# Altium project PCB_Project.PrjPcb (part 2 of 3)
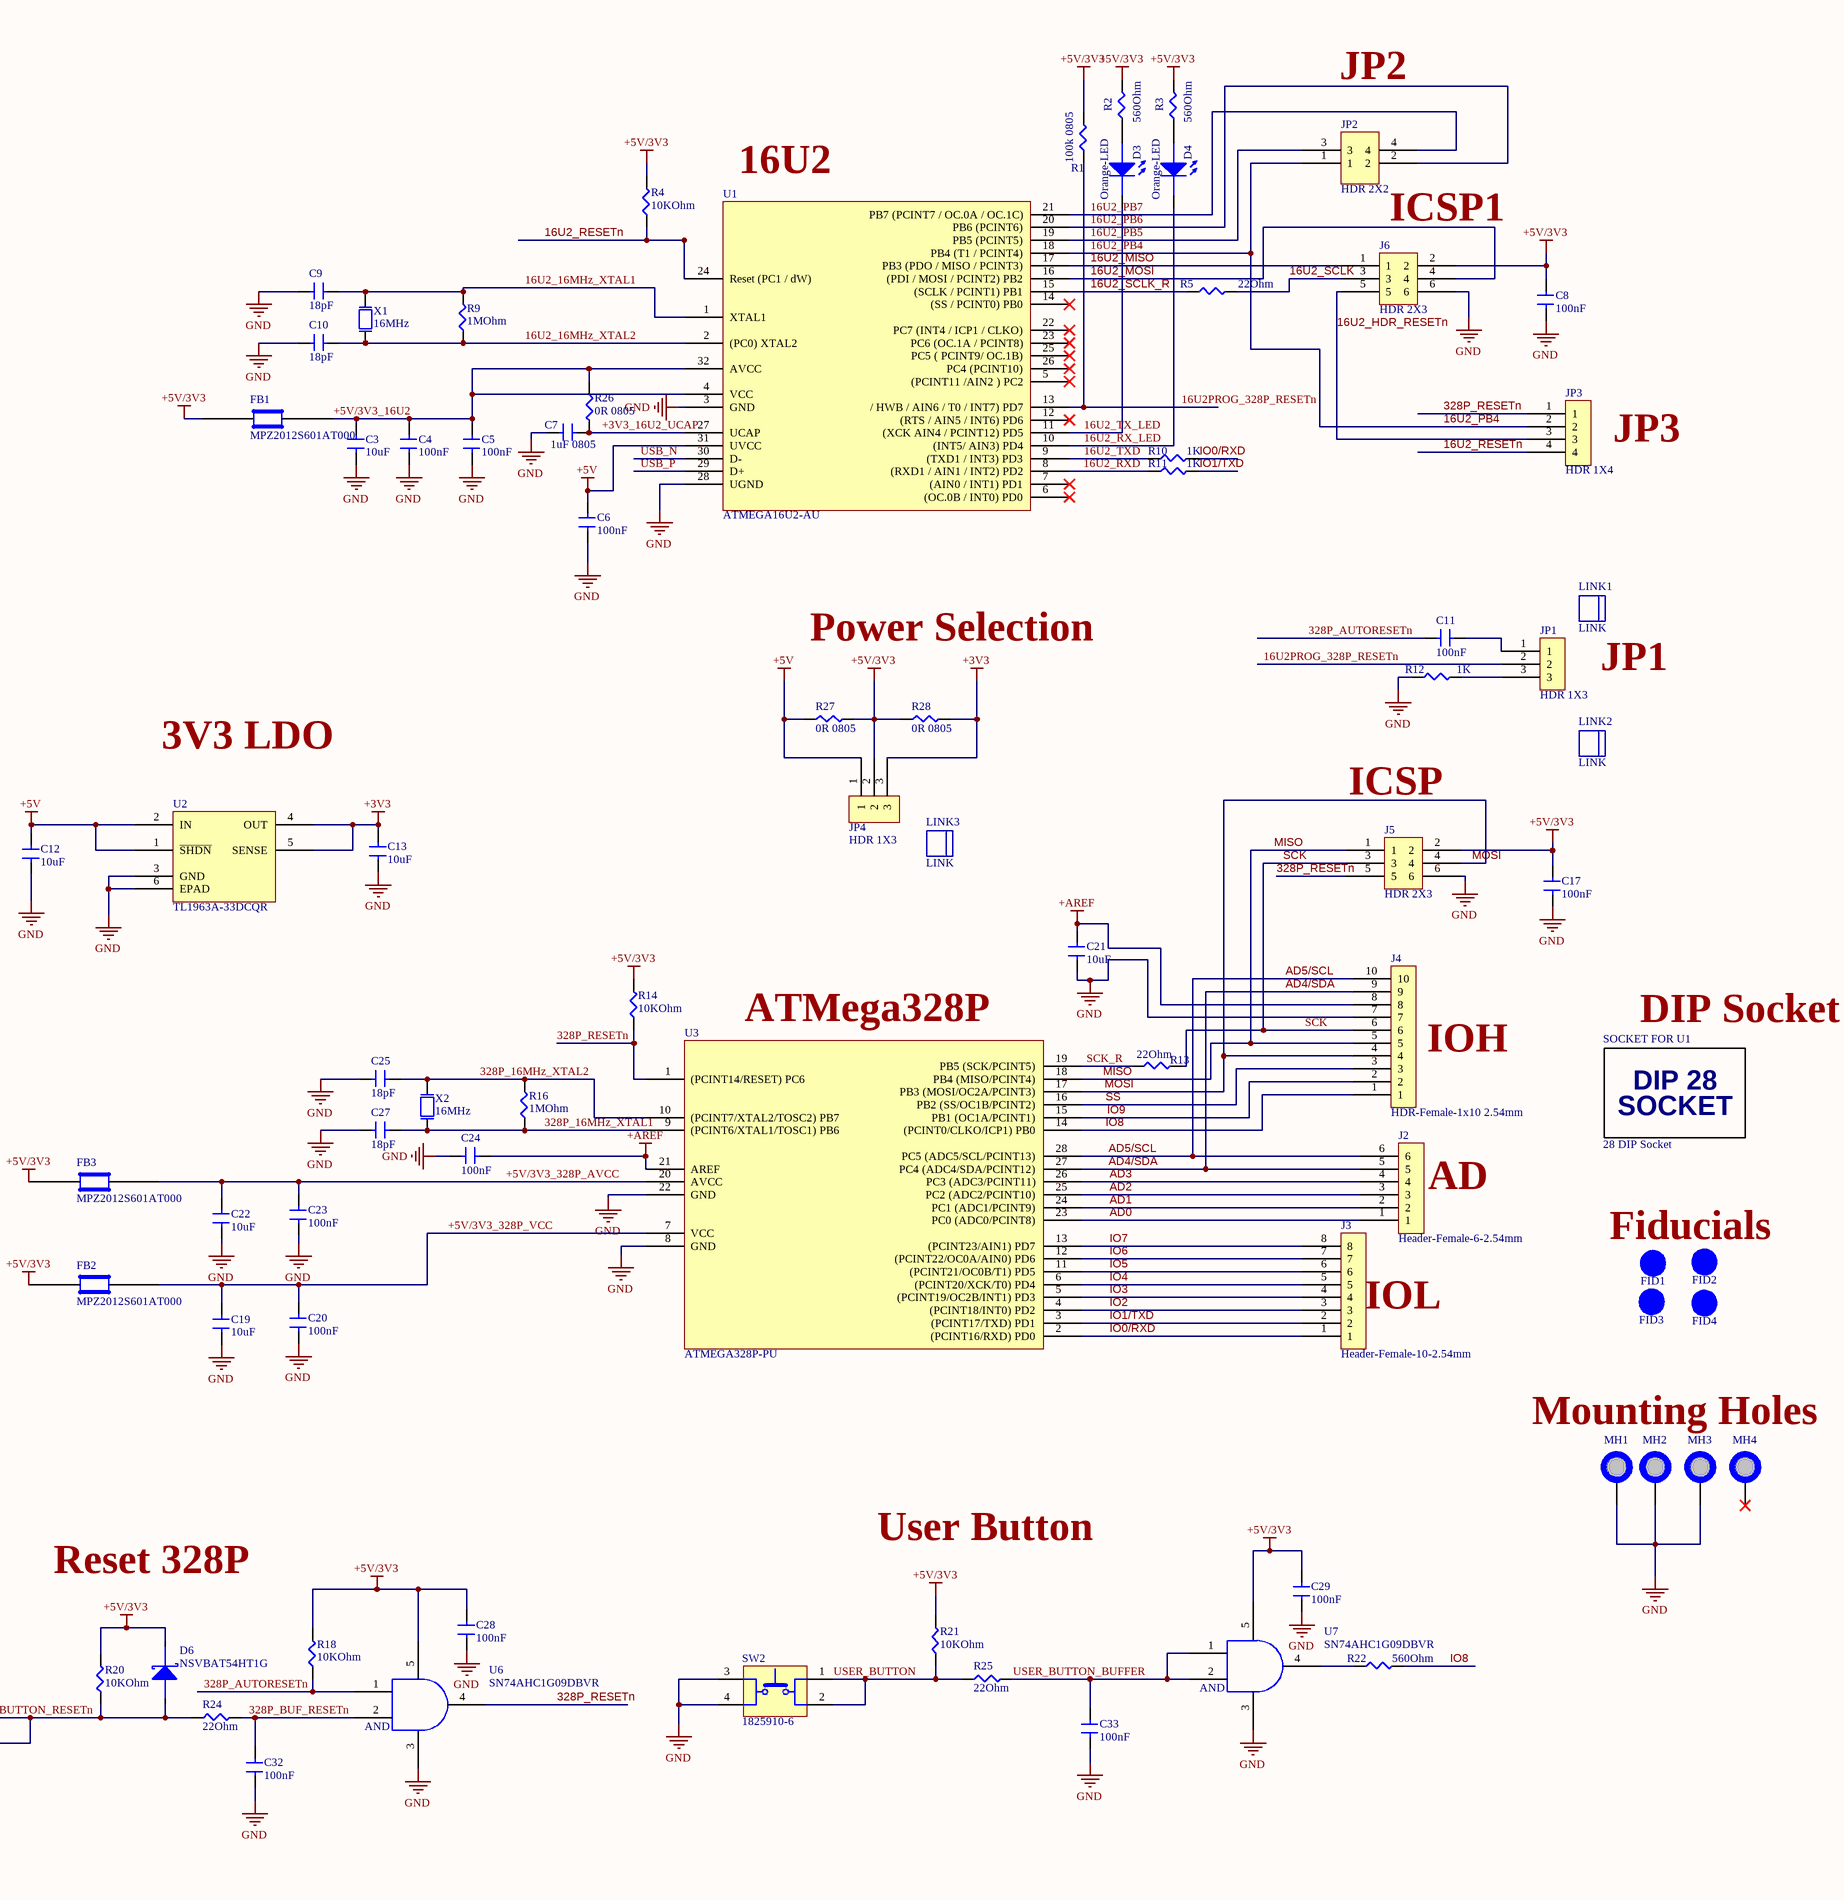
[diagram p2: Schematic.SchDoc, right]

## Sheet Schematic.SchDoc: 28 Pins (continued)
### Library data of the parts
C1 C2 = 100uF 10V: Cap Aluminum 100uF 10V 20% (5 X 5.4mm) SMD 50mA 1000 hr 85°C T/R; Manufacturer: Panasonic; Manufacturer Part Number: EEE-1AA101WR; Life (Hours): 1000Hour; Supplier 1: Digi-Key; Supplier Part Number 1: PCE3867CT-ND; RoHS: Yes; Category: Aluminum Electrolytic Capacitors; Stock 1: 119160; Pricing 1: 1=0.35000, 10=0.24300, 50=0.16180, 100=0.13740, 500=0.09702 (USD); Mount: Surface Mount,PCB; Case/Package: Radial; Contact Plating: Tin; Min Operating Temperature: -40°C; Max Operating Temperature: 85°C; Capacitance: 100uF; Voltage Rating: 10V; Tolerance: 20%; Ripple Current: 50mA; Packaging: Tape and Reel; Package Quantity: 1; Ripple Current (AC): 50mA; Voltage Rating (DC): 10V; Termination: SMD/SMT; Diameter: 5mm; Length: 5.5mm; Height: 5.4mm; Height - Seated (Max): 0.213inch; Radiation Hardening: No; REACH SVHC: Unknown; Lead Free: Lead Free; ComponentLink1URL: https://datasheet.ciiva.com/26945/getdatasheetpartid-169213-26945071.pdf?src-supplier=Verical; ComponentLink1Description: https://datasheet.ciiva.com/26945/getdatasheetpartid-169213-26945071.pdf?src-supplier=Verical; ComponentLink2URL: https://datasheet.ciiva.com/2983/aba0000ce2-2983906.pdf?src-supplier=Avnet; ComponentLink2Description: https://datasheet.ciiva.com/2983/aba0000ce2-2983906.pdf?src-supplier=Avnet; ComponentLink3URL: https://datasheet.ciiva.com/30075/11aba0000ce2-30075303.pdf?src-supplier=Onlinecomponents.com; ComponentLink3Description: https://datasheet.ciiva.com/30075/11aba0000ce2-30075303.pdf?src-supplier=Onlinecomponents.com; ComponentLink4URL: https://datasheet.ciiva.com/16427/aba0000ce2-16427544.pdf?src-supplier=Future+Electronics; ComponentLink4Description: https://datasheet.ciiva.com/16427/aba0000ce2-16427544.pdf?src-supplier=Future+Electronics; ComponentLink5URL: https://datasheet.ciiva.com/14598/70255710-14598233.pdf?src-supplier=Allied+Electronics; ComponentLink5Description: https://datasheet.ciiva.com/14598/70255710-14598233.pdf?src-supplier=Allied+Electronics; ComponentLink6URL: https://datasheet.ciiva.com/14605/70255710-14605689.pdf?src-supplier=Allied+Electronics; ComponentLink6Description: https://datasheet.ciiva.com/14605/70255710-14605689.pdf?src-supplier=Allied+Electronics; ComponentLink7URL: https://datasheet.ciiva.com/11673/aba0000ce2-11673882.pdf?src-supplier=Avnet; ComponentLink7Description: https://datasheet.ciiva.com/11673/aba0000ce2-11673882.pdf?src-supplier=Avnet; ComponentLink8URL: https://datasheet.ciiva.com/24027/aba0000ce2-40801-24027541.pdf?src-supplier=Mouser; ComponentLink8Description: https://datasheet.ciiva.com/24027/aba0000ce2-40801-24027541.pdf?src-supplier=Mouser
C3 C12 C13 C19 C21 C22 = 10uF: Ceramic capacitor SMD 0805 10 µF 16 V 10 %; Manufacturer: Samsung; Manufacturer Part Number: CL21A106KOQNNNG; Tolerance: 10%; Dielectric: X5R; Voltage: 16V; Supplier 1: Digi-Key; Supplier Part Number 1: 1276-6455-1-ND; RoHS: Yes; Category: Ceramic Capacitors; Stock 1: 689305; Pricing 1: 1=0.11000, 10=0.08300, 50=0.04500, 100=0.03680, 500=0.02626, 1000=0.02063 (USD); Mount: Surface Mount; Case/Package: 0805; Case Code (Imperial): 0805; Case Code (Metric): 2012; Material: Ceramic; Min Operating Temperature: -55°C; Max Operating Temperature: 85°C; Capacitance: 10uF; Packaging: Tape and Reel; Package Quantity: 3000; Voltage Rating: 16V; Length: 2mm; Width: 0.049inch; Height: 1.25mm; Depth: 1.25mm; Thickness: 0.053inch; ComponentLink1URL: https://datasheet.ciiva.com/25730/cl21a106koqnnng-25730226.pdf?src-supplier=Digi-Key; ComponentLink1Description: https://datasheet.ciiva.com/25730/cl21a106koqnnng-25730226.pdf?src-supplier=Digi-Key; ComponentLink2URL: https://datasheet.ciiva.com/29199/454932-da-01-en-vs-kondensator-0805-29199423.pdf?src-supplier=Conrad; ComponentLink2Description: https://datasheet.ciiva.com/29199/454932-da-01-en-vs-kondensator-0805-29199423.pdf?src-supplier=Conrad
C4-C6 C8 C11 C14-C17 C20 C23 C24 C26 C28-C34 = 100nF: Samsung Electro-Mechanics 100nF Multilayer Ceramic Capacitor (MLCC) 50 V 10% X7R dielectric CL max op. temp. +125C; Manufacturer Part Number: CL21B104KBCNNNC; Voltage Rating: 50V; Supplier 1: Digi-Key; Supplier Part Number 1: 1276-1003-1-ND; Manufacturer: Samsung; RoHS: Yes; Category: Ceramic Capacitors; Stock 1: 3107905; Pricing 1: 1=0.10000, 10=0.04700, 50=0.02560, 100=0.02100, 500=0.01498, 1000=0.01177 (USD); Mount: Surface Mount; Case/Package: 0805; Case Code (Metric): 2012; Case Code (Imperial): 0805; Material: Ceramic; Contact Plating: Tin; Min Operating Temperature: -55°C; Max Operating Temperature: 125°C; Tolerance: 10%; Packaging: Tape and Reel; Capacitance: 100nF; Dielectric: X7R; Voltage: 50V; Voltage Rating (DC): 50V; Length: 2mm; Width: 0.049inch; Height: 0.85mm; Thickness: 0.037inch; Depth: 1.25mm; Radiation Hardening: No; Lead Free: Lead Free; ComponentLink1URL: https://datasheet.ciiva.com/25710/cl21b104kbcnnnc-25710182.pdf?src-supplier=Digi-Key; ComponentLink1Description: https://datasheet.ciiva.com/25710/cl21b104kbcnnnc-25710182.pdf?src-supplier=Digi-Key; ComponentLink2URL: https://datasheet.ciiva.com/29199/454152-da-01-en-vs-kondensator-0805-29199814.pdf?src-supplier=Conrad; ComponentLink2Description: https://datasheet.ciiva.com/29199/454152-da-01-en-vs-kondensator-0805-29199814.pdf?src-supplier=Conrad
C7 = 1uF 0805: TDK - C2012X5R1E105K125AA - SMD Multilayer Ceramic Capacitor, 1 µF, 25 V, 0805 [2012 Metric], ± 10%, X5R, C Series; Voltage Rating: 25V; Supplier 1: Digi-Key; Supplier Part Number 1: 445-1419-1-ND; Manufacturer: TDK; Manufacturer Part Number: C2012X5R1E105K125AA; RoHS: Yes; Category: Ceramic Capacitors; Stock 1: 24598; Pricing 1: 1=0.23000, 10=0.15800, 50=0.09500, 100=0.08030, 500=0.05492, 1000=0.04858 (USD); Mount: Surface Mount; Case/Package: 0805; Number of Pins: 2; Dielectric Material: Ceramic; Case Code (Metric): 2012; Case Code (Imperial): 0805; Weight: 0.000194oz; Min Operating Temperature: -55°C; Max Operating Temperature: 85°C; Package Quantity: 2000; Capacitance: 1uF; Packaging: Tape and Reel; Voltage Rating (DC): 25V; Termination: SMD/SMT; Resistor Type: Ceramic; Voltage: 25V; Dielectric: X5R; Tolerance: 10%; Length: 2mm; Width: 0.049inch; Height: 1.25mm; Thickness: 0.057inch; Depth: 1.25mm; Radiation Hardening: No; Lead Free: Lead Free; REACH SVHC: No SVHC; ComponentLink1URL: https://datasheet.ciiva.com/11787/0900766b80c1bb00-11787608.pdf?src-supplier=RSComponents; ComponentLink1Description: https://datasheet.ciiva.com/11787/0900766b80c1bb00-11787608.pdf?src-supplier=RSComponents; ComponentLink2URL: https://datasheet.ciiva.com/16449/e412-c-16449595.pdf?src-supplier=Future+Electronics; ComponentLink2Description: https://datasheet.ciiva.com/16449/e412-c-16449595.pdf?src-supplier=Future+Electronics; ComponentLink3URL: https://datasheet.ciiva.com/28602/1744655-28602171.pdf?src-supplier=Element14; ComponentLink3Description: https://datasheet.ciiva.com/28602/1744655-28602171.pdf?src-supplier=Element14; ComponentLink4URL: https://datasheet.ciiva.com/15192/getdatasheetpartid-726707-15192140.pdf?src-supplier=Verical; ComponentLink4Description: https://datasheet.ciiva.com/15192/getdatasheetpartid-726707-15192140.pdf?src-supplier=Verical
C9 C10 C25 C27 = 18pF: KEMET - C0805C180K5GACTU - SMD Multilayer Ceramic Capacitor, 18 pF, 50 V, 0805 [2012 Metric], ± 10%, C0G / NP0, C Series KEMET; Voltage Rating: 50V; Dissipation Factor: 0.1%; Supplier 1: Digi-Key; Supplier Part Number 1: 399-8030-1-ND; Manufacturer: KEMET; Manufacturer Part Number: C0805C180K5GACTU; RoHS: Yes; Category: Ceramic Capacitors; Stock 1: 36978; Pricing 1: 1=0.11000, 10=0.07900, 50=0.04300, 100=0.03500, 500=0.02502, 1000=0.01966 (USD); Mount: Surface Mount; Case/Package: 0805; Case Code (Metric): 2012; Case Code (Imperial): 0805; Dielectric Material: Ceramic; Contact Plating: Tin,Matte; Min Operating Temperature: -55°C; Max Operating Temperature: 125°C; Package Quantity: 1; Capacitance: 18pF; Tolerance: 10%; Packaging: Tape and Reel; Voltage Rating (DC): 50V; Dielectric: C0G; Termination: SMD/SMT; Length: 2mm; Width: 0.049inch; Height: 0.78mm; Thickness: 0.035inch; Lead Pitch: 0.75mm; Depth: 1.25mm; Radiation Hardening: No; REACH SVHC: No SVHC; Lead Free: Lead Free; ComponentLink1URL: https://datasheet.ciiva.com/26847/getdatasheetpartid-742486-26847863.pdf?src-supplier=Verical; ComponentLink1Description: https://datasheet.ciiva.com/26847/getdatasheetpartid-742486-26847863.pdf?src-supplier=Verical; ComponentLink2URL: https://datasheet.ciiva.com/5412/kem-c1003-c0g-smd-356956-5412921.pdf?src-supplier=Mouser; ComponentLink2Description: https://datasheet.ciiva.com/5412/kem-c1003-c0g-smd-356956-5412921.pdf?src-supplier=Mouser
D1 = Green-LED: LED Uni-Color Green 572nm Automotive 2-Pin Chip 0603(1608Metric) T/R; Manufacturer: Osram Opto; Manufacturer Part Number: LGL29K-F2J1-24-Z; Lens Color: White; Forward Current: 20mA; Forward Voltage: 1.7V; Luminous Intensity: 3.5mcd; Viewing Angle: 160°; Lens Style: Flat,Diffused,Colorless,Rectangular; Lens Transparency: Diffused; Test Current: 2mA; Dominant Wavelength: 570nm; Luminous Flux: 0.015lm; Number of LEDs: 1; Lens Size: 0.8mm; Supplier 1: Digi-Key; Supplier Part Number 1: 475-3118-1-ND; RoHS: Yes; Category: Uncategorized; Mount: Surface Mount; Case/Package: 0603; Number of Pins: 2; Color: Green; Case Code (Metric): 1608; Case Code (Imperial): 0603; Min Operating Temperature: -40°C; Max Operating Temperature: 100°C; Packaging: Tape and Reel; Package Quantity: 5000; Illumination Color: Green; Length: 1.7mm; Width: 0.8mm; Height: 0.65mm; Radiation Hardening: No; ComponentLink1URL: http://components.arrow.com/part/dataview/41971649S9781339N2128?src-supplier=Arrow+Electronics; ComponentLink1Description: http://components.arrow.com/part/dataview/41971649S9781339N2128?src-supplier=Arrow+Electronics; ComponentLink2URL: http://components.arrow.com/part/dataview/0323_02006818?src-supplier=Arrow+Europe; ComponentLink2Description: http://components.arrow.com/part/dataview/0323_02006818?src-supplier=Arrow+Europe; ComponentLink3URL: http://catalog.osram-os.com/catalogue/catalogue.do;jsessionid=3DE84243E85F820603DAFD5199D8DDA3?act=downloadFile&favOid=020000020000138e000100b6&src-supplier=Avnet; ComponentLink3Description: http://catalog.osram-os.com/catalogue/catalogue.do;jsessionid=3DE84243E85F820603DAFD5199D8DDA3?act=downloadFile&favOid=020000020000138e000100b6&src-supplier=Avnet; ComponentLink4URL: https://dammedia.osram.info/media/resource/hires/osram-dam-2493945/LG%20L29K.pdf?src-supplier=Digi-Key; ComponentLink4Description: https://dammedia.osram.info/media/resource/hires/osram-dam-2493945/LG%20L29K.pdf?src-supplier=Digi-Key; ComponentLink5URL: http://catalog.osram-os.com/catalogue/catalogue.do;jsessionid=3DE84243E85F820603DAFD5199D8DDA3?act=downloadFile&favOid=020000020000138e000100b6&src-supplier=Avnet+Europe; ComponentLink5Description: http://catalog.osram-os.com/catalogue/catalogue.do;jsessionid=3DE84243E85F820603DAFD5199D8DDA3?act=downloadFile&favOid=020000020000138e000100b6&src-supplier=Avnet+Europe
D2-D4 = Orange-LED: OSRAM - LO L29K-H2K1-24-Z - SMARTLED 0603 ORANGE; Manufacturer: Osram Opto; Lens Color: White; Forward Current: 20mA; Forward Voltage: 2.2V; Luminous Intensity: 9mcd; Viewing Angle: 160°; Test Current: 2mA; Lens Style: Flat,Diffused,Colorless,Rectangular; Dominant Wavelength: 606nm; Luminous Flux: 0.025lm; Lens Transparency: Diffused; Number of Elements: 1; Reverse Voltage: 12V; Lens Size: 0.8mm; Supplier 1: Digi-Key; Supplier Part Number 1: 475-2740-2-ND; Manufacturer Part Number: LOL29K-H2K1-24-Z; RoHS: Yes; Category: Uncategorized; Mount: Surface Mount; Case/Package: 0603; Number of Pins: 2; Case Code (Metric): 1608; Color: Orange; Case Code (Imperial): 0603; Min Operating Temperature: -40°C; Max Operating Temperature: 100°C; Illumination Color: Orange; Packaging: Tape and Reel; Package Quantity: 5000; Number of LEDs: 1; Length: 1.3mm; Width: 0.8mm; Height: 0.65mm; Depth: 0.8mm; Radiation Hardening: No; ComponentLink1URL: https://datasheet.ciiva.com/2112/00077105-0-2112904.pdf?src-supplier=Digi-Key; ComponentLink1Description: https://datasheet.ciiva.com/2112/00077105-0-2112904.pdf?src-supplier=Digi-Key; ComponentLink2URL: https://datasheet.ciiva.com/2112/00077105-0-2112905.pdf?src-supplier=Digi-Key; ComponentLink2Description: https://datasheet.ciiva.com/2112/00077105-0-2112905.pdf?src-supplier=Digi-Key; ComponentLink3URL: https://datasheet.ciiva.com/2112/00077105-0-2112906.pdf?src-supplier=Digi-Key; ComponentLink3Description: https://datasheet.ciiva.com/2112/00077105-0-2112906.pdf?src-supplier=Digi-Key; ComponentLink4URL: https://datasheet.ciiva.com/15198/getdatasheetpartid-693885-15198412.pdf?src-supplier=Verical; ComponentLink4Description: https://datasheet.ciiva.com/15198/getdatasheetpartid-693885-15198412.pdf?src-supplier=Verical
D5 D6 = NSVBAT54HT1G: Schottky Diodes & Rectifiers SS SCHOTTKY DIODE; Manufacturer: ON Semiconductor; Forward Current: 200mA; Forward Voltage: 800mV; Max Power Dissipation: 200mW; Recovery Time: 5ns; Max Repetitive Reverse Voltage (Vrrm): 30V; Peak Non-Repetitive Surge Current: 600mA; Element Configuration: Single; Supplier 1: Digi-Key; Supplier Part Number 1: NSVBAT54HT1GOSCT-ND; Manufacturer Part Number: NSVBAT54HT1G; RoHS: Yes; Category: Schottky Diodes; Stock 1: 8813; Pricing 1: 1=0.48000, 10=0.34200, 100=0.17230, 500=0.15266, 1000=0.11880 (USD); Case/Package: SOD-323-2; Number of Pins: 2; Min Operating Temperature: -55°C; Max Operating Temperature: 150°C; Package Quantity: 3000; Packaging: Tape and Reel; Average Rectified Current: 200mA; Reverse Recovery Time: 5ns; Max Forward Surge Current (Ifsm): 600mA; Max Reverse Voltage (DC): 30V; Length: 1.8mm; Width: 1.35mm; Height: 0.9mm; Radiation Hardening: No; Lead Free: Lead Free; Halogen Free: Halogen Free; ComponentLink1URL: https://datasheet.ciiva.com/923/bat54ht1-d-923204.pdf?src-supplier=Digi-Key; ComponentLink1Description: https://datasheet.ciiva.com/923/bat54ht1-d-923204.pdf?src-supplier=Digi-Key; ComponentLink2URL: https://datasheet.ciiva.com/25932/bat54ht1-d-25932182.pdf?src-supplier=Avnet+Europe; ComponentLink2Description: https://datasheet.ciiva.com/25932/bat54ht1-d-25932182.pdf?src-supplier=Avnet+Europe
FB1-FB3 = MPZ2012S601AT000: FERRITE BEAD 600 OHM 0805 1LN; Manufacturer: TDK; Impedance: 600R; Current Rating: 2A; DC Resistance (DCR): 100mR; Supplier 1: Digi-Key; Supplier Part Number 1: 445-2206-1-ND; Manufacturer Part Number: MPZ2012S601AT000; RoHS: Yes; Category: Ferrite Beads and Chips; Stock 1: 186163; Pricing 1: 1=0.11000, 10=0.09200, 25=0.08240, 50=0.06040, 100=0.05220, 250=0.04116, 500=0.03478, 1000=0.02928 (USD); Mount: Surface Mount; Case/Package: 0805; Case Code (Metric): 2012; Case Code (Imperial): 0805; Packaging: Tape and Reel; Package Quantity: 1; Max DC Current: 2A; Length: 0.079inch; Width: 0.049inch; Height: 0.041inch; REACH SVHC: No SVHC; Lead Free: Lead Free; ComponentLink1URL: https://datasheet.ciiva.com/46634/beads-commercial-power-mpz-en-46634377.pdf?src-supplier=Digi-Key; ComponentLink1Description: https://datasheet.ciiva.com/46634/beads-commercial-power-mpz-en-46634377.pdf?src-supplier=Digi-Key; ComponentLink2URL: https://datasheet.ciiva.com/46634/beads-commercial-power-mpz-en-46634606.pdf?src-supplier=Digi-Key; ComponentLink2Description: https://datasheet.ciiva.com/46634/beads-commercial-power-mpz-en-46634606.pdf?src-supplier=Digi-Key; ComponentLink3URL: https://datasheet.ciiva.com/46634/beads-commercial-power-mpz-en-46634335.pdf?src-supplier=Digi-Key; ComponentLink3Description: https://datasheet.ciiva.com/46634/beads-commercial-power-mpz-en-46634335.pdf?src-supplier=Digi-Key
J1 J3 = Header-Female-8-2.54mm: CONN HDR 8POS 0.1 TIN PCB; Manufacturer: Sullins; Manufacturer Part Number: PPTC081LFBN-RC; Number of Positions: 8; Connector Type: Header,Socket; Pitch: 0.1inch; Supplier 1: Digi-Key; Supplier Part Number 1: S7006-ND; RoHS: Yes; Category: Connectors; Stock 1: 90645; Pricing 1: 1=0.65000, 10=0.60800, 100=0.46580, 500=0.40500, 1000=0.33413, 5000=0.29363, 10000=0.29250 (USD); Mount: Through Hole; Housing Material: Plastic; Contact Plating: Tin; Color: Black; Contact Material: Bronze; Package Quantity: 1000; Number of Rows: 1; Packaging: Bulk; Termination: Solder; Length: 20.8mm; Width: 2.5mm; Height: 8.5mm; Lead Free: Lead Free; ComponentLink1URL: https://media.digikey.com/pdf/Data%20Sheets/Sullins%20PDFs/Female_Headers.100_DS.pdf?src-supplier=Digi-Key; ComponentLink1Description: https://media.digikey.com/pdf/Data%20Sheets/Sullins%20PDFs/Female_Headers.100_DS.pdf?src-supplier=Digi-Key; ComponentLink2URL: http://www.sullinscorp.com/catalogs/78_Page80-81_HEADER_.100_2.54mm_FEMALE.pdf?src-supplier=Future+Electronics; ComponentLink2Description: http://www.sullinscorp.com/catalogs/78_Page80-81_HEADER_.100_2.54mm_FEMALE.pdf?src-supplier=Future+Electronics
J2 = Header-Female-6-2.54mm: Female, 6 C, Straight, .100"CC; 3.20mm Tail, No Mt. 100u" Tin; PBT, Phos Bronze, 105 C; Manufacturer: Sullins; Manufacturer Part Number: PPTC061LFBN-RC; Connector Type: Header,Socket; Number of Positions: 6; Pitch: 0.1inch; Supplier 1: Digi-Key; Supplier Part Number 1: S7004-ND; RoHS: Yes; Category: Connectors; Stock 1: 39129; Pricing 1: 1=0.52000, 10=0.48300, 100=0.37050, 500=0.32220, 1000=0.26582, 5000=0.23360, 10000=0.23270 (USD); Mount: Through Hole; Contact Material: Bronze; Housing Material: Plastic; Color: Black; Contact Plating: Tin; Package Quantity: 1000; Packaging: Bulk; Number of Rows: 1; Termination: Solder; Length: 15.7mm; Width: 2.5mm; Height: 8.5mm; Lead Free: Lead Free; ComponentLink1URL: https://media.digikey.com/pdf/Data%20Sheets/Sullins%20PDFs/Female_Headers.100_DS.pdf?src-supplier=Digi-Key; ComponentLink1Description: https://media.digikey.com/pdf/Data%20Sheets/Sullins%20PDFs/Female_Headers.100_DS.pdf?src-supplier=Digi-Key; ComponentLink2URL: http://www.sullinscorp.com/catalogs/78_Page80-81_HEADER_.100_2.54mm_FEMALE.pdf?src-supplier=Future+Electronics; ComponentLink2Description: http://www.sullinscorp.com/catalogs/78_Page80-81_HEADER_.100_2.54mm_FEMALE.pdf?src-supplier=Future+Electronics
J4 = Header-Female-2.54mm-10: CONN HDR 10POS 0.079 GOLD PCB; Manufacturer: Sullins; Manufacturer Part Number: NPPN101BFCN-RC; Current Rating: 1A; Gender: Female; Insulation Resistance: 5GR; Connector Type: Header,Socket; Number of Positions: 10; Pitch: 0.079inch; Supplier 1: Digi-Key; Supplier Part Number 1: S5751-10-ND; RoHS: Yes; Category: Connectors; Stock 1: 147597; Pricing 1: 1=0.98000, 10=0.86500, 100=0.74650, 500=0.61074, 1000=0.54288, 5000=0.49010 (USD); Mount: Through Hole; Contact Material: Bronze; Material: Nylon; Color: Black; Contact Plating: Gold; Min Operating Temperature: -40°C; Max Operating Temperature: 105°C; Termination: Solder; Package Quantity: 1000; Number of Rows: 1; Packaging: Bulk; Lead Free: Lead Free; ComponentLink1URL: https://datasheet.ciiva.com/745/75-1bfc-10483-745511.pdf?src-supplier=Digi-Key; ComponentLink1Description: https://datasheet.ciiva.com/745/75-1bfc-10483-745511.pdf?src-supplier=Digi-Key
J5 J6 = HDR 2X3: BOARD-BOARD CONNECTOR HEADER, 6 POSITION, 2ROW; Product Range:AMPMODU Mod II Series; Contact Termination Type:Through Hole; Gender:Header; No. of Contacts:6; Pitch Spacing:2.54mm; Contact Plating:Gold Plated Contacts; No. of Rows:2 ;RoHS Compliant: Yes; Manufacturer: TE Connectivity; Manufacturer Part Number: 87227-3; Number of Positions: 6; Insulation Resistance: 5GR; Board Standoff: No (Without); High Speed Serial Data Connector: No; PCB Mount Retention: Without; Gender: Male; Connector Type: Connector,Pin; Contact Current Rating: 3A; Pitch: 2.54mm; Contact Post Length: 0.125inch; PCB Thickness: 1.4mm; Approvals: CSA,UL; Supplier 1: Digi-Key; Supplier Part Number 1: A26569-ND; RoHS: Yes; Category: Connectors; Stock 1: 8708; Pricing 1: 1=2.64000, 10=2.39300, 100=2.05120, 500=1.70934, 1000=1.46514, 5000=1.29909, 10000=1.26979 (USD); Mount: Through Hole; Contact Shape: Square; Housing Material: Thermoplastic; Contact Plating: Gold; Contact Material: Bronze; Color: Black; Housing Color: Black; Min Operating Temperature: -65°C; Max Operating Temperature: 105°C; Termination: Through Hole; Number of Contacts: 6; Contact Protection: No (Without); Gasket: No (Without); High Temperature Housing: No; Keyed: No; Mating Alignment: No (Without); Mating Connector Lock: No (Without); Panel Mount Retention: No (Without); Selectively Loaded: No (Without); Stabilizers: No (Without); Strain Relief: No (Without); Contact Gender: Male; Current Rating: 3A; Package Quantity: 520; Packaging: Carton; Number of Rows: 2; Orientation: Straight; Mounting Ears: No (Without); Length: 7.21mm; Row Spacing: 2.54mm; Contact Mating Length: 8.08mm; Depth: 5.08mm; Radiation Hardening: No; REACH SVHC: Unknown; ELV: Compliant; Lead Free: Lead Free; Flammability Rating: UL94 V-0; ComponentLink1URL: https://datasheet.ciiva.com/27055/1934542-27055082.pdf?src-supplier=Jameco; ComponentLink1Description: https://datasheet.ciiva.com/27055/1934542-27055082.pdf?src-supplier=Jameco; ComponentLink2URL: https://datasheet.ciiva.com/710/eng-cd-87227-h4-710306.pdf?src-supplier=Digi-Key; ComponentLink2Description: https://datasheet.ciiva.com/710/eng-cd-87227-h4-710306.pdf?src-supplier=Digi-Key; ComponentLink3URL: https://datasheet.ciiva.com/8047/eng-cs-1307819-section-5-0908-8047543.pdf?src-supplier=Element14; ComponentLink3Description: https://datasheet.ciiva.com/8047/eng-cs-1307819-section-5-0908-8047543.pdf?src-supplier=Element14; ComponentLink4URL: https://datasheet.ciiva.com/16684/eng-ds-1307819-ampmodu-0811-16684234.pdf?src-supplier=Avnet+Europe; ComponentLink4Description: https://datasheet.ciiva.com/16684/eng-ds-1307819-ampmodu-0811-16684234.pdf?src-supplier=Avnet+Europe; ComponentLink5URL: https://datasheet.ciiva.com/3118/eng-ds-1307819-ampmodu-0811-3118588.pdf?src-supplier=Avnet; ComponentLink5Description: https://datasheet.ciiva.com/3118/eng-ds-1307819-ampmodu-0811-3118588.pdf?src-supplier=Avnet; ComponentLink6URL: https://datasheet.ciiva.com/14645/70082847-14645500.pdf?src-supplier=Allied+Electronics; ComponentLink6Description: https://datasheet.ciiva.com/14645/70082847-14645500.pdf?src-supplier=Allied+Electronics; ComponentLink7URL: https://datasheet.ciiva.com/15175/getdatasheetpartid-36807-15175478.pdf?src-supplier=Verical; ComponentLink7Description: https://datasheet.ciiva.com/15175/getdatasheetpartid-36807-15175478.pdf?src-supplier=Verical
J7 = 10118193-0001LF: CONN USB MICRO B RECPT SMT R/A; Manufacturer: Amphenol FCI; Number of Terminals/Pins: 5; Gender: Female; Current Rating: 1.8A; Connector Type: USB,Receptacle; Number of Ports: 1; Insulation Resistance: 1GR; Max Voltage Rating (AC): 100V; Pitch: 0.65mm; Supplier 1: Digi-Key; Supplier Part Number 1: 609-4616-1-ND; Manufacturer Part Number: 10118193-0001LF; RoHS: Yes; Category: USB Connectors; Stock 1: 41614; Pricing 1: 1=0.48000, 10=0.45100, 25=0.38680, 50=0.32860, 100=0.31580, 250=0.28360, 500=0.27070 (USD); Mount: Surface Mount,Horizontal; Contact Plating: Gold; Contact Material: Copper Alloy; Housing Material: Polymer; Color: Black; Min Operating Temperature: -55°C; Max Operating Temperature: 85°C; Packaging: Tape and Reel; Number of Contacts: 5; Termination: Solder; Package Quantity: 1200; Voltage Rating: 100V; Orientation: Right Angle; Features: Shielded; Length: 7.86mm; Depth: 5.67mm; Radiation Hardening: No; Flammability Rating: UL94 V-0; ComponentLink1URL: https://datasheet.ciiva.com/851/10118193-851106.pdf?src-supplier=Digi-Key; ComponentLink1Description: https://datasheet.ciiva.com/851/10118193-851106.pdf?src-supplier=Digi-Key; ComponentLink2URL: https://datasheet.ciiva.com/26853/getdatasheetpartid-418618-26853893.pdf?src-supplier=Verical; ComponentLink2Description: https://datasheet.ciiva.com/26853/getdatasheetpartid-418618-26853893.pdf?src-supplier=Verical; ComponentLink3URL: https://datasheet.ciiva.com/4598/10118193ac-197151-4598799.pdf?src-supplier=Mouser; ComponentLink3Description: https://datasheet.ciiva.com/4598/10118193ac-197151-4598799.pdf?src-supplier=Mouser; ComponentLink4URL: https://datasheet.ciiva.com/14802/10118193-0001lf-webpage-14802386.pdf?src-supplier=Arrow+Electronics; ComponentLink4Description: https://datasheet.ciiva.com/14802/10118193-0001lf-webpage-14802386.pdf?src-supplier=Arrow+Electronics; ComponentLink5URL: https://datasheet.ciiva.com/851/10118193-851107.pdf?src-supplier=Digi-Key; ComponentLink5Description: https://datasheet.ciiva.com/851/10118193-851107.pdf?src-supplier=Digi-Key; ComponentLink6URL: https://datasheet.ciiva.com/851/10118193-851108.pdf?src-supplier=Digi-Key; ComponentLink6Description: https://datasheet.ciiva.com/851/10118193-851108.pdf?src-supplier=Digi-Key; ComponentLink7URL: https://datasheet.ciiva.com/14618/70236827-14618887.pdf?src-supplier=Allied+Electronics; ComponentLink7Description: https://datasheet.ciiva.com/14618/70236827-14618887.pdf?src-supplier=Allied+Electronics
J8 J9 = PAD_WITH_HOLE_4mmx1.5mm
JP1 JP4 = HDR 1X3: BERGSTIK II .100" SR STRAIGHT; Manufacturer: Amphenol FCI; Manufacturer Part Number: 68001-403HLF; Connector Type: Male Pin; Number of Positions: 3; Max Voltage Rating (AC): 1.5kV; Gender: Male; Insulation Resistance: 5GR; Current Rating: 3A; Pitch: 2.54mm; Contact Post Length: 3.05mm; Supplier 1: Digi-Key; Supplier Part Number 1: 609-3471-ND; RoHS: Yes; Category: Headers and Wire Housings; Stock 1: 1924; Pricing 1: 1=0.20000, 10=0.18400, 100=0.12740, 500=0.10780, 1000=0.08820, 5000=0.07840, 10000=0.07105 (USD); Mount: Through Hole; Housing Material: Thermoplastic; Housing Color: Black; Contact Plating: Tin; Contact Material: Bronze; Color: Black; Min Operating Temperature: -65°C; Max Operating Temperature: 125°C; Termination: Solder; Number of Contacts: 3; Orientation: Straight; Number of Rows: 1; Packaging: Bulk; Package Quantity: 100; Voltage Rating: 1.5kV; Contact Gender: Male; Length: 7.62mm; Depth: 2.41mm; Contact Mating Length: 0.23inch; Radiation Hardening: No; REACH SVHC: No SVHC; Flammability Rating: UL94 V-0; ComponentLink1URL: https://datasheet.ciiva.com/731/68000-731069.pdf?src-supplier=Digi-Key; ComponentLink1Description: https://datasheet.ciiva.com/731/68000-731069.pdf?src-supplier=Digi-Key; ComponentLink2URL: https://datasheet.ciiva.com/10149/68000-10149609.pdf?src-supplier=Avnet; ComponentLink2Description: https://datasheet.ciiva.com/10149/68000-10149609.pdf?src-supplier=Avnet; ComponentLink3URL: https://datasheet.ciiva.com/22872/70302503-22872970.pdf?src-supplier=Allied+Electronics; ComponentLink3Description: https://datasheet.ciiva.com/22872/70302503-22872970.pdf?src-supplier=Allied+Electronics
JP2 = HDR 2X2: 67996-404HLF-BERG II 100CC DR ST ;ROHS COMPLIANT: YES; Manufacturer: Amphenol FCI; Connector Type: Male Pin; Voltage Rating: 1.5kV; Number of Positions: 4; Gender: Male; Current Rating: 3A; Insulation Resistance: 5GR; Pitch: 2.54mm; Row Spacing: 0.1inch; Contact Post Length: 2.41mm; Supplier 1: Digi-Key; Supplier Part Number 1: 609-3390-ND; Manufacturer Part Number: 67996-404HLF; RoHS: Yes; Category: Headers and Wire Housings; Stock 1: 2384; Pricing 1: 1=0.24000, 10=0.22400, 100=0.15520, 500=0.13134, 1000=0.10746, 5000=0.09552, 10000=0.08657 (USD); Mount: Through Hole; Housing Material: Thermoplastic; Color: Black; Housing Color: Black; Contact Plating: Tin; Contact Material: Bronze; Min Operating Temperature: -65°C; Max Operating Temperature: 125°C; Number of Rows: 2; Packaging: Bulk; Package Quantity: 100; Orientation: Straight; Termination: Solder; Max Voltage Rating (AC): 1.5kV; Contact Gender: Male; Number of Contacts: 4; Length: 5.08mm; Depth: 4.83mm; Contact Mating Length: 0.23inch; Radiation Hardening: No; Lead Free: Lead Free; ComponentLink1URL: https://datasheet.ciiva.com/721/67996-721035.pdf?src-supplier=Digi-Key; ComponentLink1Description: https://datasheet.ciiva.com/721/67996-721035.pdf?src-supplier=Digi-Key; ComponentLink2URL: https://datasheet.ciiva.com/10149/67996-10149733.pdf?src-supplier=Avnet; ComponentLink2Description: https://datasheet.ciiva.com/10149/67996-10149733.pdf?src-supplier=Avnet; ComponentLink3URL: https://datasheet.ciiva.com/16726/67996-16726280.pdf?src-supplier=Avnet+Europe; ComponentLink3Description: https://datasheet.ciiva.com/16726/67996-16726280.pdf?src-supplier=Avnet+Europe
JP3 = HDR 1X4: CONN HEADER VERT 4POS 2.54MM; Manufacturer: Amphenol FCI; Manufacturer Part Number: 68000-204HLF; Number of Positions: 4; Max Voltage Rating (AC): 1.5kV; Gender: Male; Connector Type: Male Pin; Insulation Resistance: 5GR; Current Rating: 3A; Contact Post Length: 2.41mm; Supplier 1: Digi-Key; Supplier Part Number 1: 609-3255-ND; RoHS: Yes; Category: Connectors; Stock 1: 1643; Pricing 1: 1=0.33000, 10=0.31600, 100=0.22150, 500=0.18984, 1000=0.15820, 5000=0.13560, 10000=0.12656 (USD); Mount: Through Hole; Housing Color: Black; Color: Black; Contact Plating: Gold,GXT; Contact Material: Bronze; Housing Material: Thermoplastic; Min Operating Temperature: -65°C; Max Operating Temperature: 125°C; Termination: Solder; Number of Contacts: 4; Orientation: Straight; Package Quantity: 100; Number of Rows: 1; Packaging: Bulk; Voltage Rating: 1.5kV; Contact Gender: Male; Length: 10.16mm; Pitch: 2.54mm; Depth: 2.41mm; Contact Mating Length: 0.23inch; Radiation Hardening: No; Flammability Rating: UL94 V-0; ComponentLink1URL: https://datasheet.ciiva.com/5149/68000-274280-5149869.pdf?src-supplier=Mouser; ComponentLink1Description: https://datasheet.ciiva.com/5149/68000-274280-5149869.pdf?src-supplier=Mouser; ComponentLink2URL: https://datasheet.ciiva.com/728/68000-728901.pdf?src-supplier=Digi-Key; ComponentLink2Description: https://datasheet.ciiva.com/728/68000-728901.pdf?src-supplier=Digi-Key; ComponentLink3URL: https://datasheet.ciiva.com/22873/70302489-22873093.pdf?src-supplier=Allied+Electronics; ComponentLink3Description: https://datasheet.ciiva.com/22873/70302489-22873093.pdf?src-supplier=Allied+Electronics; ComponentLink4URL: https://datasheet.ciiva.com/10149/68000-10149835.pdf?src-supplier=Avnet; ComponentLink4Description: https://datasheet.ciiva.com/10149/68000-10149835.pdf?src-supplier=Avnet; ComponentLink5URL: https://datasheet.ciiva.com/46395/1914865-46395853.pdf?src-supplier=Element14; ComponentLink5Description: https://datasheet.ciiva.com/46395/1914865-46395853.pdf?src-supplier=Element14
L1 = 2.2uH: FIXED IND 2.2UH 2A 80 MOHM SMD; Manufacturer: KEMET; Manufacturer Part Number: L1210R2R2MDWIT; Core Material: Ferrite; Tolerance: 20%; Shielding: Unshielded; Self Resonant Frequency: 190MHz; DC Resistance (DCR): 80mR; Test Frequency: 100kHz; DC Current: 1.13A; Supplier 1: Digi-Key; Supplier Part Number 1: 399-9598-1-ND; RoHS: Yes; Category: Fixed Inductors; Stock 1: 15069; Pricing 1: 1=0.48000, 10=0.41700, 25=0.38680, 50=0.32720, 100=0.29750, 250=0.27964, 500=0.24990 (USD); Mount: Surface Mount; Case/Package: 1210; Case Code (Metric): 3225; Case Code (Imperial): 1210; Min Operating Temperature: -40°C; Max Operating Temperature: 105°C; Package Quantity: 1000; Current Rating: 2A; Packaging: Tape and Reel; Inductance Tolerance: 20%; Resistor Type: Wirewound,Ceramic; Inductance: 2.2uH; Max DC Current: 2A; Termination: SMD/SMT; Length: 0.126inch; Width: 0.098inch; Height: 2.5mm; Height - Seated (Max): 0.106inch; Depth: 2.7mm; Radiation Hardening: No; REACH SVHC: No SVHC; Military Standard: Not; ComponentLink1URL: https://datasheet.ciiva.com/4957/f3115-4957838.pdf?src-supplier=Mouser; ComponentLink1Description: https://datasheet.ciiva.com/4957/f3115-4957838.pdf?src-supplier=Mouser; ComponentLink2URL: https://datasheet.ciiva.com/6691/f3115-6691487.pdf?src-supplier=Digi-Key; ComponentLink2Description: https://datasheet.ciiva.com/6691/f3115-6691487.pdf?src-supplier=Digi-Key; ComponentLink3URL: https://datasheet.ciiva.com/8512/f3115-8512543.pdf?src-supplier=Avnet; ComponentLink3Description: https://datasheet.ciiva.com/8512/f3115-8512543.pdf?src-supplier=Avnet; ComponentLink4URL: https://datasheet.ciiva.com/17280/f3115-17280270.pdf?src-supplier=Avnet+Europe; ComponentLink4Description: https://datasheet.ciiva.com/17280/f3115-17280270.pdf?src-supplier=Avnet+Europe; ComponentLink5URL: https://datasheet.ciiva.com/22685/27262-22685038.pdf?src-supplier=Element14; ComponentLink5Description: https://datasheet.ciiva.com/22685/27262-22685038.pdf?src-supplier=Element14
LINK1-LINK3 = LINK: CONN JUMPER SHORTING .100" GOLD; Manufacturer: Sullins; Manufacturer Part Number: QPC02SXGN-RC; Number of Positions: 2; Pitch: 0.1inch; Supplier 1: Digi-Key; Supplier Part Number 1: S9337-ND; RoHS: Yes; Category: Connectors; Stock 1: 716811; Pricing 1: 1=0.10000, 25=0.04400, 50=0.03780, 250=0.03152, 750=0.02835, 1000=0.02646, 12000=0.02016, 24000=0.01827, 48000=0.01820 (USD); Case/Package: 100; Contact Plating: Gold; Package Quantity: 2000; Packaging: Bulk; Height: 0.235inch; Lead Free: Lead Free; ComponentLink1URL: https://datasheet.ciiva.com/767/284-sxgn-11510-767869.pdf?src-supplier=Digi-Key; ComponentLink1Description: https://datasheet.ciiva.com/767/284-sxgn-11510-767869.pdf?src-supplier=Digi-Key
R1 = 100k 0805: YAGEO         RC0805FR-07100KL            RES, THICK FILM, 100K, 1%, 0.125W, 0805, REEL; Resistance: 100kR; Temperature Coefficient: 100ppm/°C; Voltage Rating (DC): 150V; Power Rating: 125mW; Supplier 1: Digi-Key; Supplier Part Number 1: 311-100KCRCT-ND; Manufacturer: Yageo; Manufacturer Part Number: RC0805FR-07100KL; RoHS: Yes; Category: Chip SMD Resistors; Stock 1: 2366254; Pricing 1: 1=0.10000, 10=0.03600, 100=0.01470, 1000=0.00660, 2500=0.00573 (USD); Case/Package: 0805; Number of Pins: 2; Case Code (Metric): 2012; Case Code (Imperial): 0805; Min Operating Temperature: -55°C; Max Operating Temperature: 155°C; Tolerance: 1%; Packaging: Tape and Reel; Resistor Type: Thick Film; Voltage Rating: 150V; Package Quantity: 1; Number of Terminations: 2; Termination: SMD/SMT; Max Power Dissipation: 125mW; Features: Moisture Resistant; Length: 2mm; Width: 0.049inch; Height: 0.024inch; Depth: 1.25mm; Lead Pitch: 0.4mm; REACH SVHC: Unknown; Lead Free: Lead Free; Military Standard: Not
R2 R3 R15 R17 R22 = 560Ohm: RES SMD 560 OHM 1% 1/8W 0805; Manufacturer: Yageo; Manufacturer Part Number: RT0805FRE07560RL; Resistance: 560R; Power Rating: 125mW; Voltage Rating: 150V; Temperature Coefficient: 50ppm/°C; Supplier 1: Digi-Key; Supplier Part Number 1: 13-RT0805FRE07560RLCT-ND; RoHS: Yes; Category: Chip SMD Resistors; Stock 1: 9840; Pricing 1: 1=0.10000, 10=0.08000, 100=0.03100, 1000=0.01362, 2500=0.01176 (USD); Case/Package: 0805; Number of Pins: 2; Case Code (Imperial): 0805; Case Code (Metric): 2012; Contact Plating: Tin,Matte; Min Operating Temperature: -55°C; Max Operating Temperature: 125°C; Tolerance: 1%; Packaging: Tape and Reel; Package Quantity: 5000; Resistor Type: Thin Film; Termination: SMD/SMT; Number of Terminations: 2; Max Power Dissipation: 125mW; Voltage Rating (DC): 150V; Length: 2mm; Width: 1.25mm; Height: 0.024inch; Depth: 1.25mm; Radiation Hardening: No; REACH SVHC: No SVHC; Military Standard: Not; Lead Free: Lead Free; ComponentLink1URL: https://datasheet.ciiva.com/12834/pyu-rt-1-to-0-05-rohs-l-4-12834166.pdf?src-supplier=Mouser; ComponentLink1Description: https://datasheet.ciiva.com/12834/pyu-rt-1-to-0-05-rohs-l-4-12834166.pdf?src-supplier=Mouser; ComponentLink2URL: https://datasheet.ciiva.com/2561/pyu-rt-1-to-0-05-rohs-l-5-2561303.pdf?src-supplier=Digi-Key; ComponentLink2Description: https://datasheet.ciiva.com/2561/pyu-rt-1-to-0-05-rohs-l-5-2561303.pdf?src-supplier=Digi-Key; ComponentLink3URL: https://datasheet.ciiva.com/7942/1392914-7942159.pdf?src-supplier=Element14; ComponentLink3Description: https://datasheet.ciiva.com/7942/1392914-7942159.pdf?src-supplier=Element14
R4 R14 R18-R21 = 10KOhm: RES SMD 10K OHM 1% 1/8W 0805; Manufacturer: Yageo; Manufacturer Part Number: AC0805FR-0710KL; Resistance: 10kR; Power Rating: 125mW; Voltage Rating: 150V; Temperature Coefficient: 100ppm/°C; Supplier 1: Digi-Key; Supplier Part Number 1: 311-10KLGCT-ND; RoHS: Yes; Category: Chip SMD Resistors; Stock 1: 428651; Pricing 1: 1=0.10000, 10=0.04400, 100=0.01780, 1000=0.00798, 2500=0.00692 (USD); Case/Package: 0805; Case Code (Metric): 2012; Case Code (Imperial): 0805; Min Operating Temperature: -55°C; Max Operating Temperature: 155°C; Packaging: Tape and Reel; Tolerance: 1%; Package Quantity: 1; Resistor Type: Thick Film; Number of Terminations: 2; Termination: SMD/SMT; Max Power Dissipation: 125mW; Features: Moisture Resistant,Automotive AEC-Q200,Anti-Sulfur; Length: 0.079inch; Width: 0.049inch; Height: 0.024inch; Depth: 1.25mm; Military Standard: Not; Lead Free: Lead Free; ComponentLink1URL: https://datasheet.ciiva.com/5558/pyu-ac-51-rohs-l-2-5558347.pdf?src-supplier=Mouser; ComponentLink1Description: https://datasheet.ciiva.com/5558/pyu-ac-51-rohs-l-2-5558347.pdf?src-supplier=Mouser
R5-R7 R13 R23-R25 = 22Ohm: YAGEO         RC0805FR-072R2L             RES, THICK FILM, 2R2, 1%, 0.125W, 0805; Temperature Coefficient: 200ppm/°C; Resistance: 2.2R; Power Rating: 125mW; Voltage Rating: 150V; Supplier 1: Digi-Key; Supplier Part Number 1: 311-2.20CRCT-ND; Manufacturer: Yageo; Manufacturer Part Number: RC0805FR-072R2L; RoHS: Yes; Category: Chip SMD Resistors; Stock 1: 157807; Pricing 1: 1=0.10000, 10=0.07200, 100=0.02940, 1000=0.01322, 2500=0.01148 (USD); Case/Package: 0805; Number of Pins: 2; Case Code (Imperial): 0805; Case Code (Metric): 2012; Min Operating Temperature: -55°C; Max Operating Temperature: 155°C; Tolerance: 1%; Packaging: Tape and Reel; Termination: SMD/SMT; Resistor Type: Thick Film; Voltage Rating (DC): 150V; Length: 2mm; Width: 1.25mm; Height: 0.5mm; Depth: 1.25mm; Lead Free: Lead Free; REACH SVHC: No SVHC; Military Standard: Not; ComponentLink1URL: https://datasheet.ciiva.com/11808/0900766b8106beab-11808233.pdf?src-supplier=RSComponents; ComponentLink1Description: https://datasheet.ciiva.com/11808/0900766b8106beab-11808233.pdf?src-supplier=RSComponents; ComponentLink2URL: https://datasheet.ciiva.com/46447/444164-46447576.pdf?src-supplier=Element14; ComponentLink2Description: https://datasheet.ciiva.com/46447/444164-46447576.pdf?src-supplier=Element14
R8 R26-R28 = 0R 0805: Surface Mount Thick Film Resistor, RC Series, 125 mW, - 5%, 150 V, 0805 [2012 Metric]; Manufacturer: Yageo; Manufacturer Part Number: RC0805JR-070RL; Resistance: 0mR; Voltage Rating: 150V; Power Rating: 125mW; Temperature Coefficient: 200ppm/°C; Supplier 1: Digi-Key; Supplier Part Number 1: 311-0.0ARCT-ND; RoHS: Yes; Category: Chip SMD Resistors; Stock 1: 4227385; Pricing 1: 1=0.10000, 10=0.03100, 25=0.02240, 50=0.01720, 100=0.01260, 250=0.00964, 500=0.00770, 1000=0.00567 (USD); Case/Package: 0805; Number of Pins: 2; Case Code (Imperial): 0805; Case Code (Metric): 2012; Contact Plating: Tin,Matte; Min Operating Temperature: -55°C; Max Operating Temperature: 155°C; Packaging: Tape and Reel; Tolerance: 5%; Voltage Rating (DC): 150V; Termination: SMD/SMT; Resistor Type: Thick Film; Length: 2mm; Width: 1.25mm; Height: 0.5mm; Depth: 1.25mm; Radiation Hardening: No; REACH SVHC: Unknown; Military Standard: Not; Lead Free: Lead Free; ComponentLink1URL: https://datasheet.ciiva.com/7941/1738694-7941861.pdf?src-supplier=Element14; ComponentLink1Description: https://datasheet.ciiva.com/7941/1738694-7941861.pdf?src-supplier=Element14; ComponentLink2URL: https://datasheet.ciiva.com/11819/0900766b8106beab-11819430.pdf?src-supplier=RSComponents; ComponentLink2Description: https://datasheet.ciiva.com/11819/0900766b8106beab-11819430.pdf?src-supplier=RSComponents; ComponentLink3URL: https://datasheet.ciiva.com/7941/1738694-7941862.pdf?src-supplier=Element14; ComponentLink3Description: https://datasheet.ciiva.com/7941/1738694-7941862.pdf?src-supplier=Element14; ComponentLink4URL: https://datasheet.ciiva.com/7941/1738694-7941863.pdf?src-supplier=Element14; ComponentLink4Description: https://datasheet.ciiva.com/7941/1738694-7941863.pdf?src-supplier=Element14; ComponentLink5URL: https://datasheet.ciiva.com/15190/getdatasheetpartid-330685-15190028.pdf?src-supplier=Verical; ComponentLink5Description: https://datasheet.ciiva.com/15190/getdatasheetpartid-330685-15190028.pdf?src-supplier=Verical
R9 R16 = 1MOhm: Resistor; Thick Film; Res 1 Megohms; Pwr-Rtg 0.125 W; Tol 1%; SMT; 0805; Manufacturer: TE Connectivity; Manufacturer Part Number: CRG0805F1M0; Power Rating: 125mW; Resistance: 1MR; Temperature Coefficient: 100ppm/°C; Number of Resistors: 1; Voltage Rating: 150V; Supplier 1: Digi-Key; Supplier Part Number 1: A106058CT-ND; RoHS: Yes; Category: Chip SMD Resistors; Stock 1: 35900; Pricing 1: 1=0.10000, 10=0.04500, 100=0.01820, 1000=0.00816, 2500=0.00708 (USD); Mount: Surface Mount; Case/Package: 0805; Min Operating Temperature: -55°C; Max Operating Temperature: 125°C; Tolerance: 1%; Resistor Type: Thick Film; Termination: Solder; Packaging: Tape and Reel; Number of Terminations: 2; Length: 2mm; Height: 0.55mm; Depth: 1.25mm; Radiation Hardening: No; ELV: Compliant; ComponentLink1URL: https://datasheet.ciiva.com/11809/0900766b800a696e-11809028.pdf?src-supplier=RSComponents; ComponentLink1Description: https://datasheet.ciiva.com/11809/0900766b800a696e-11809028.pdf?src-supplier=RSComponents; ComponentLink2URL: https://datasheet.ciiva.com/24365/eng-ds-1773204-e-24365336.pdf?src-supplier=Onlinecomponents.com; ComponentLink2Description: https://datasheet.ciiva.com/24365/eng-ds-1773204-e-24365336.pdf?src-supplier=Onlinecomponents.com; ComponentLink3URL: https://datasheet.ciiva.com/16761/70063020-16761419.pdf?src-supplier=Allied+Electronics; ComponentLink3Description: https://datasheet.ciiva.com/16761/70063020-16761419.pdf?src-supplier=Allied+Electronics
R10-R12 = 1KOhm: RESISTOR, 0805 1K 1%, FULL REEL; Product Range:YAGEO - RC Series; Resistance:1kohm; Power Rating:125mW; Resistance Tolerance:± 1%; Resistor Case Style:0805 [2012 Metric]; Resistor Element Material:Thick Film; Temperature Coefficient:± 250ppm/°C; Voltage Rating:150V; Packaging:Tape & Reel; MSL:-; SVHC:No SVHC (16-Dec-2013); External Depth:0.55mm; External Length / Height:2mm; External Width:1.25mm; No. of Pins:2; Operating Temperature Max:155°C; Operating Temperature Min:-55°C; Operating Temperature Range:-55°C to +155°C; Reel Quantity:5000; Resistor Mounting:SMD; Series:RC12H; Temperature Coef; Manufacturer: Yageo; Manufacturer Part Number: RC0805FR-071KL; Resistance: 1kR; Temperature Coefficient: 100ppm/°C; Voltage Rating (DC): 150V; Power Rating: 125mW; Supplier 1: Digi-Key; Supplier Part Number 1: 311-1.00KCRCT-ND; RoHS: Yes; Category: Chip SMD Resistors; Stock 1: 14565963; Pricing 1: 1=0.10000, 10=0.03600, 100=0.01470, 1000=0.00660, 2500=0.00573 (USD); Case/Package: 0805; Number of Pins: 2; Case Code (Metric): 2012; Case Code (Imperial): 0805; Min Operating Temperature: -55°C; Max Operating Temperature: 155°C; Tolerance: 1%; Packaging: Tape and Reel; Resistor Type: Thick Film; Package Quantity: 1; Voltage Rating: 150V; Number of Terminations: 2; Termination: SMD/SMT; Max Power Dissipation: 125mW; Features: Moisture Resistant; Length: 0.079inch; Width: 0.049inch; Height: 0.024inch; Depth: 1.25mm; REACH SVHC: Unknown; Lead Free: Lead Free; Military Standard: Not
SOCKET_FOR_U1 = 28 DIP Socket: CONN IC DIP SOCKET 28POS TIN; Manufacturer: 3M; Manufacturer Part Number: 4828-6000-CP; Current Rating: 1A; Voltage Rating (AC): 100V; Gender: Female; Insulation Resistance: 5GR; Number of Positions: 28; Connector Type: DIP,Socket; Pitch: 2.54mm; Row Spacing: 15.24mm; Supplier 1: Digi-Key; Supplier Part Number 1: 3M5469-ND; RoHS: Yes; Category: IC and Component Sockets; Stock 1: 802; Pricing 1: 1=0.81000, 10=0.71500, 25=0.67240, 50=0.64440, 100=0.61640, 250=0.56040, 500=0.50436, 1000=0.44832, 2500=0.40629 (USD); Mount: Through Hole; Housing Material: Polyester; Contact Material: Bronze; Contact Plating: Tin,Nickel; Min Operating Temperature: -25°C; Max Operating Temperature: 85°C; Packaging: Rail/Tube; Number of Rows: 2; Orientation: Straight; Termination: Solder; Number of Contacts: 28; Package Quantity: 14; Length: 35.43mm; Width: 17.78mm; Depth: 5.08mm; Flammability Rating: UL94 V-0; Lead Free: Lead Free; ComponentLink1URL: https://datasheet.ciiva.com/768/ts1099-768352.pdf?src-supplier=Digi-Key; ComponentLink1Description: https://datasheet.ciiva.com/768/ts1099-768352.pdf?src-supplier=Digi-Key; ComponentLink2URL: https://datasheet.ciiva.com/8006/ts1099-8006725.pdf?src-supplier=Element14; ComponentLink2Description: https://datasheet.ciiva.com/8006/ts1099-8006725.pdf?src-supplier=Element14
SW1 SW2 = 1825910-6: SWITCH TACTILE SPST-NO 0.05A 24V; Manufacturer: TE Connectivity Alcoswitch; Mechanical Life: 100000Cycles; Actuator Material: PBT; Max Current Rating: 50mA; Throw Configuration: SPST; Operating Force: 160gf; Contact Resistance: 100mR; Illumination Type: Non-Illuminated,Illuminated; Switch Travel: 0.25mm; Switch Function: Off-Mom; Actuator Type: Standard; Actuator Length: 0.055inch; Supplier 1: Digi-Key; Supplier Part Number 1: 450-1650-ND; Manufacturer Part Number: 1825910-6; RoHS: Yes; Category: Pushbutton Switches; Stock 1: 132569; Pricing 1: 1=0.10000, 10=0.10100, 25=0.09560, 100=0.08700, 250=0.08180, 500=0.07484, 1000=0.06265, 5000=0.05743, 10000=0.05395 (USD); Mount: Through Hole; Contact Material: Copper Alloy; Contact Plating: Silver; Min Operating Temperature: -35°C; Max Operating Temperature: 85°C; Package Quantity: 750; Packaging: Loose Piece; Max Voltage Rating (DC): 24V; Termination: PC Pins; Electrical Life: 100000Cycles; Orientation: Straight; Contact Current Rating: 50mA; Type: Switch; Length: 5.99mm; Lead Free: Lead Free; REACH SVHC: Unknown; ELV: Compliant; ComponentLink1URL: https://datasheet.ciiva.com/30199/1825910-6rqpn1825910-6-30199520.pdf?src-supplier=Onlinecomponents.com; ComponentLink1Description: https://datasheet.ciiva.com/30199/1825910-6rqpn1825910-6-30199520.pdf?src-supplier=Onlinecomponents.com; ComponentLink2URL: https://datasheet.ciiva.com/15184/getdatasheetpartid-395915-15184509.pdf?src-supplier=Verical; ComponentLink2Description: https://datasheet.ciiva.com/15184/getdatasheetpartid-395915-15184509.pdf?src-supplier=Verical
U1 = ATMEGA16U2-AU: MICROCHIP - ATMEGA16U2-AU - MCU, 8BIT, MEGAAVR, 16MHZ, TQFP-32; Manufacturer: Microchip / Atmel; Core Architecture: AVR; Interface: SPI,UART,USB,USART,Serial; Data Bus Width: 8b; Memory Type: FLASH; Memory Size: 16KB; RAM Size: 512B; Number of I/Os: 22; Number of Timers/Counters: 2; Max Supply Voltage: 5.5V; Min Supply Voltage: 2.7V; Oscillator Type: Internal; Watchdog Timer: Yes; Peripherals: Brown-out Detect/Reset,POR,PWM,WDT; Number of PWM Channels: 5; Number of SPI Channels: 1; Supplier 1: LCSC; Supplier Part Number 1: C59019; Manufacturer Part Number: ATMEGA16U2-AU; RoHS: Yes; Category: Microcontrollers; Stock 1: 180; Pricing 1: 1=4.95400, 10=4.24290, 30=4.11190, 100=3.98300, 500=3.92500, 1000=3.85200, 1=4.84230, 10=4.14730, 30=4.01920, 100=3.89330, 500=3.83660, 1000=3.76510, 1=24.68870, 10=21.14520, 30=20.49200, 100=19.84990, 500=19.56080, 1000=19.19670, 1=22.90960, 10=19.62150, 30=19.01530, 100=18.41950, 500=18.15120, 1000=17.81330, 1=3.07940, 10=2.63740, 30=2.55600, 100=2.47590, 500=2.43980, 1000=2.39440, 1=2.79570, 10=2.39440, 30=2.32050, 100=2.24770, 500=2.21500, 1000=2.17380, 1=29.33180, 10=25.12200, 30=24.34590, 100=23.58300, 500=23.23960, 1000=22.80690, 1=391.10050, 10=334.96760, 30=324.61970, 100=314.44760, 500=309.86810, 1000=304.09970, 1=15.28260, 10=13.08920, 30=12.68480, 100=12.28740, 500=12.10840, 1000=11.88300, 1=278.51520, 10=238.54120, 30=231.17210, 100=223.92820, 500=220.66700, 1000=216.55920, 1=30.95280, 10=26.51030, 30=25.69130, 100=24.88620, 500=24.52380, 1000=24.06730, 1=5.01440, 10=4.29470, 30=4.16200, 100=4.03160, 500=3.97290, 1000=3.89890, 1=3.78330, 10=3.24030, 30=3.14020, 100=3.04180, 500=2.99750, 1000=2.94170 (AUD); Mount: Surface Mount; Case/Package: A; Number of Pins: 32; Contact Plating: Tin,Matte; Min Operating Temperature: -40°C; Max Operating Temperature: 85°C; Package Quantity: 1250; Frequency: 16MHz; Packaging: Tray; Number of Programmable I/O: 22; Max Frequency: 16MHz; Length: 7mm; Width: 7mm; Height: 1.05mm; REACH SVHC: No SVHC; Lead Free: Lead Free; ComponentLink1URL: https://datasheet.ciiva.com/13036/doc7799-28769-13036800.pdf?src-supplier=Mouser; ComponentLink1Description: https://datasheet.ciiva.com/13036/doc7799-28769-13036800.pdf?src-supplier=Mouser; ComponentLink2URL: https://datasheet.ciiva.com/22651/doc7799-22651110.pdf?src-supplier=Farnell; ComponentLink2Description: https://datasheet.ciiva.com/22651/doc7799-22651110.pdf?src-supplier=Farnell